# EAGLE design pmu (EAGLE 6.4)
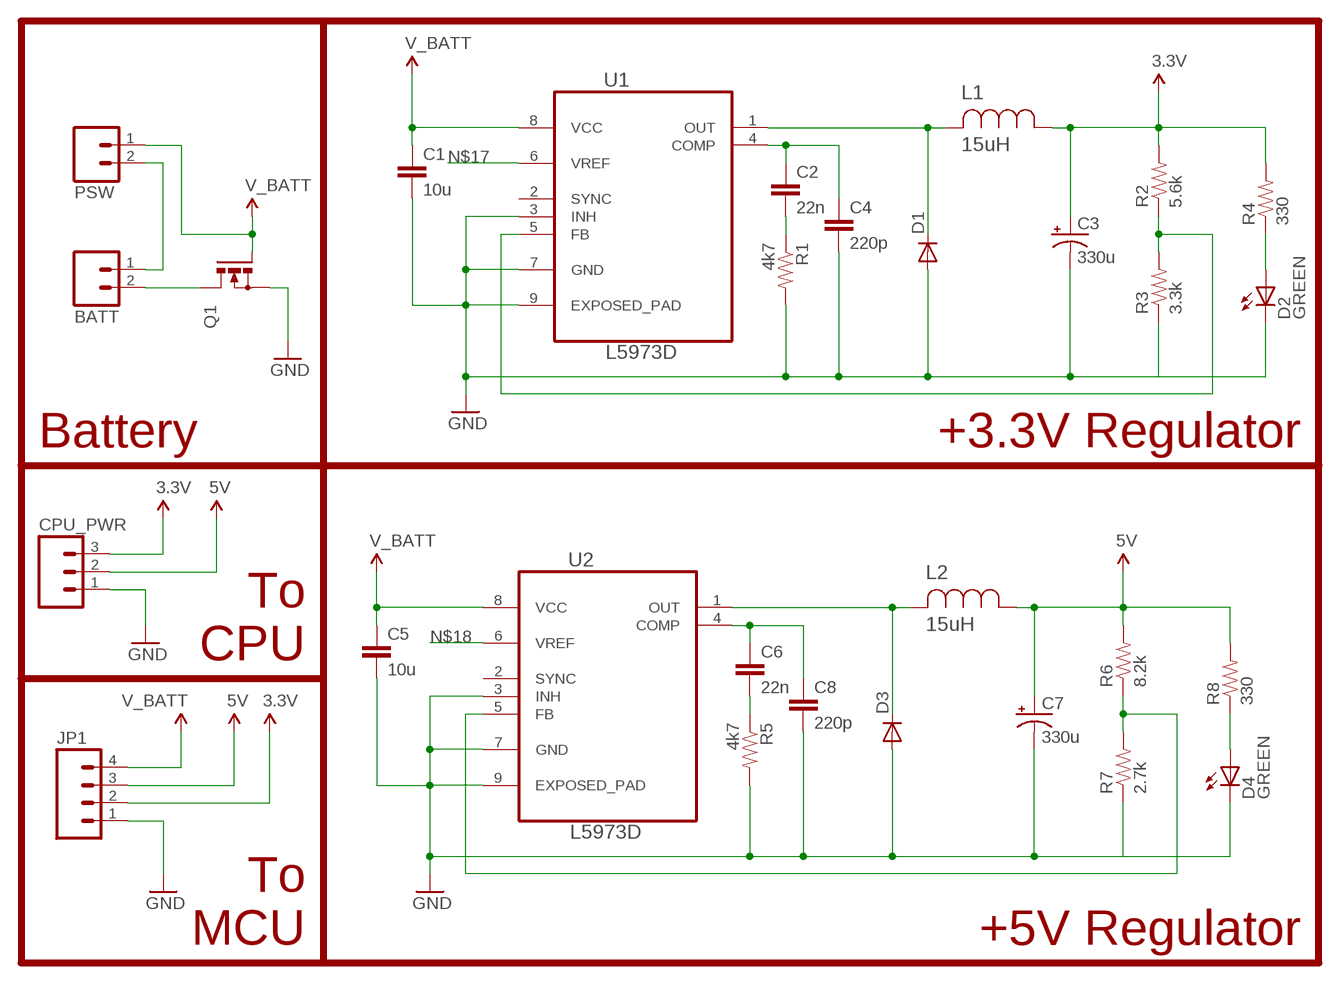
[diagram p0: schematic, sheet 1]

## Parts
BATT  M02PTH  [1X02]
C1  10u  CAP1210  [1210]
C2  22n  CAP0805  [0805]
C3  330u  CAP_POL7343  [EIA7343]
C4  220p  CAP0805  [0805]
C5  10u  CAP1210  [1210]
C6  22n  CAP0805  [0805]
C7  330u  CAP_POL7343  [EIA7343]
C8  220p  CAP0805  [0805]
CPU_PWR  M03PTH  [1X03]
D1  DIODESMB  [SMB-DIODE]
D2  GREEN  LEDCHIP-LED0805  [CHIP-LED0805]
D3  DIODESMB  [SMB-DIODE]
D4  GREEN  LEDCHIP-LED0805  [CHIP-LED0805]
JP1  M04PTH  [1X04]
L1  15uH  ELL8TP150MB-8TP  [IND_ELL8TP]
L2  15uH  ELL8TP150MB-8TP  [IND_ELL8TP]
PSW  M02PTH  [1X02]
Q1  N-MOSFET-SO8S  [SO-08]
R1  4k7  RESISTOR0805-RES  [0805]
R2  5.6k  RESISTOR0805-RES  [0805]
R3  3.3k  RESISTOR0805-RES  [0805]
R4  330  RESISTOR0805-RES  [0805]
R5  4k7  RESISTOR0805-RES  [0805]
R6  8.2k  RESISTOR0805-RES  [0805]
R7  2.7k  RESISTOR0805-RES  [0805]
R8  330  RESISTOR0805-RES  [0805]
U1  L5973D  [SOP127P600X170-9N]
U2  L5973D  [SOP127P600X170-9N]

## Nets
3.3V: C3.A(+) CPU_PWR.3 JP1.2 L1.1 R2.2 R4.2
5V: C7.A(+) CPU_PWR.2 JP1.3 L2.1 R6.2 R8.2
GND: C1.2 C3.C(-) C4.2 C5.2 C7.C(-) C8.2 CPU_PWR.1 D1.A D2.C D3.A D4.C JP1.1 Q1.1(S) Q1.2(S) Q1.3(S) R1.2 R3.1 R5.2 R7.1 U1.3(INH) U1.7(GND) U1.9(EXPOSED_PAD) U2.3(INH) U2.7(GND) U2.9(EXPOSED_PAD)
N$1: C2.1 C4.1 U1.4(COMP)
N$2: C2.2 R1.1
N$3: D1.C L1.2 U1.1(OUT)
N$4: BATT.2 Q1.5(D) Q1.6(D) Q1.7(D) Q1.8(D)
N$5: R2.1 R3.2 U1.5(FB)
N$6: D2.A R4.1
N$8: C6.1 C8.1 U2.4(COMP)
N$9: C6.2 R5.1
N$10: D3.C L2.2 U2.1(OUT)
N$11: R6.1 R7.2 U2.5(FB)
N$12: D4.A R8.1
N$17: U1.6(VREF)
N$18: U2.6(VREF)
N$22: BATT.1 PSW.2
V_BATT: C1.1 C5.1 JP1.4 PSW.1 Q1.4(G) U1.8(VCC) U2.8(VCC)
Unconnected: U1.2(SYNC) U2.2(SYNC)

## Notes on the sheet
- Battery | +3.3V Regulator
- To
  CPU
- To
  MCU
- +5V Regulator

## Library data of the parts
BATT PSW = SparkFun-Connectors:M02: Standard 2-pin 0.1" header. Use with - straight break away headers ( PRT-00116) - right angle break away headers (PRT-00553) - swiss pins (PRT-00743) - machine pins (PRT-00117) - female headers (PRT-00115) Molex polarized connector foot print use with: PRT-08233 with associated crimp pins and housings. 2.54_SCREWTERM for use with PRT-10571. 3.5mm Screw Terminal footprints for PRT-08084 5mm Screw Terminal footprints for use with PRT-08433
C1 C2 C4-C6 C8 = SparkFun-Passives:CAP: Capacitor Standard 0603 ceramic capacitor, and 0.1" leaded capacitor.
C3 C7 = SparkFun-Passives:CAP_POL: Capacitor Polarized These are standard SMD and PTH capacitors. Normally 10uF, 47uF, and 100uF in electrolytic and tantalum varieties. Always verify the external diameter of the through hole cap, it varies with capacity, voltage, and manufacturer. The EIA devices should be standard.
CPU_PWR = SparkFun-Connectors:M03: Header 3 Standard 3-pin 0.1" header. Use with straight break away headers (SKU : PRT-00116), right angle break away headers (PRT-00553), swiss pins (PRT-00743), machine pins (PRT-00117), and female headers (PRT-00115). Molex polarized connector foot print use with SKU : PRT-08232 with associated crimp pins and housings.
D1 D3 = SparkFun-DiscreteSemi:DIODE: Diode These are standard reverse protection diodes and small signal diodes. SMA package can handle up to about 1A. SOD-323 can handle about 200mA. What the SOD-323 package when ordering, there are some mfgs out there that are 5-pin packages.
D2 D4 = led:LED: LED OSRAM: - CHIPLED LG R971, LG N971, LY N971, LG Q971, LY Q971, LO R971, LY R971 LH N974, LH R974 LS Q976, LO Q976, LY Q976 LO Q996 - Hyper CHIPLED LW Q18S LB Q993, LB Q99A, LB R99A - SideLED LS A670, LO A670, LY A670, LG A670, LP A670 LB A673, LV A673, LT A673, LW A673 LH A674 LY A675 LS A676, LA A676, LO A676, LY A676, LW A676 LS A679, LY A679, LG A679 - Hyper Micro SIDELED® LS Y876, LA Y876, LO Y876, LY Y876 LT Y87S - SmartLED LW L88C, LW L88S LB L89C, LB L89S, LG L890 LS L89K, LO L89K, LY L89K LS L896, LA L896, LO L896, LY L896 - TOPLED LS T670, LO T670, LY T670, LG T670, LP T670 LSG T670, LSP T670, LSY T670, LOP T670, LYG T670 LG T671, LOG T671, LSG T671 LB T673, LV T673, LT T673, LW T673 LH T674 LS T676, LA T676, LO T676, LY T676, LB T676, LH T676, LSB T676, LW T676 LB T67C, LV T67C, LT T67C, LS T67K, LO T67K, LY T67K, LW E67C LS E67B, LA E67B, LO E67B, LY E67B, LB E67C, LV E67C, LT E67C LW T67C LS T679, LY T679, LG T679 LS T770, LO T770, LY T770, LG T770, LP T770 LB T773, LV T773, LT T773, LW T773 LH T774 LS E675, LA E675, LY E675, LS T675 LS T776, LA T776, LO T776, LY T776, LB T776 LHGB T686 LT T68C, LB T68C - Hyper Mini TOPLED® LB M676 - Mini TOPLED Santana® LG M470 LS M47K, LO M47K, LY M47K Source: http://www.osram.convergy.de LUXEON: - LUMILED® LXK2-PW12-R00, LXK2-PW12-S00, LXK2-PW14-U00, LXK2-PW14-V00 LXK2-PM12-R00, LXK2-PM12-S00, LXK2-PM14-U00 LXK2-PE12-Q00, LXK2-PE12-R00, LXK2-PE12-S00, LXK2-PE14-T00, LXK2-PE14-U00 LXK2-PB12-K00, LXK2-PB12-L00, LXK2-PB12-M00, LXK2-PB14-N00, LXK2-PB14-P00, LXK2-PB14-Q00 LXK2-PR12-L00, LXK2-PR12-M00, LXK2-PR14-Q00, LXK2-PR14-R00 LXK2-PD12-Q00, LXK2-PD12-R00, LXK2-PD12-S00 LXK2-PH12-R00, LXK2-PH12-S00 LXK2-PL12-P00, LXK2-PL12-Q00, LXK2-PL12-R00 Source: www.luxeon.com KINGBRIGHT: KA-3528ASYC Source: www.kingbright.com
JP1 = SparkFun-Connectors:M04: Header 4 Standard 4-pin 0.1" header. Use with straight break away headers (SKU : PRT-00116), right angle break away headers (PRT-00553), swiss pins (PRT-00743), machine pins (PRT-00117), and female headers (PRT-00115). Molex polarized connector foot print use with SKU : PRT-08231 with associated crimp pins and housings. 1MM SMD Version SKU: PRT-10208
L1 L2 = Panasonic-ELL:ELL: Choke Coils; CURRENTRATING: 2.3A; MPN: ELL8TP150MB; OC_FARNELL: 1865673; OC_NEWARK: 56T0928; PACKAGE: SMD; SUPPLIER: PANASONIC; VALUE: 15UH
Q1 = transistor-power:N-MOSFET-SO8: N-Channel MOSFET Example: FDS7760A; N-Channel Logic Level PowerTrench® MOSFET FDS2572; N-Channel UltraFET® Trench MOSFET Source: www.fairchildsemi.com
R1-R8 = SparkFun-Passives:RESISTOR: Resistor Basic schematic elements and footprints for 0603, 1206, and PTH resistors.
U1 U2 = L5973D:L5973D: 2.5 A switch step down switching regulator; MPN: L5973D; OC_FARNELL: 1077145; OC_NEWARK: 05M3335; PACKAGE: HSOP8; SUPPLIER: STMICROELECTRONICS

## Board
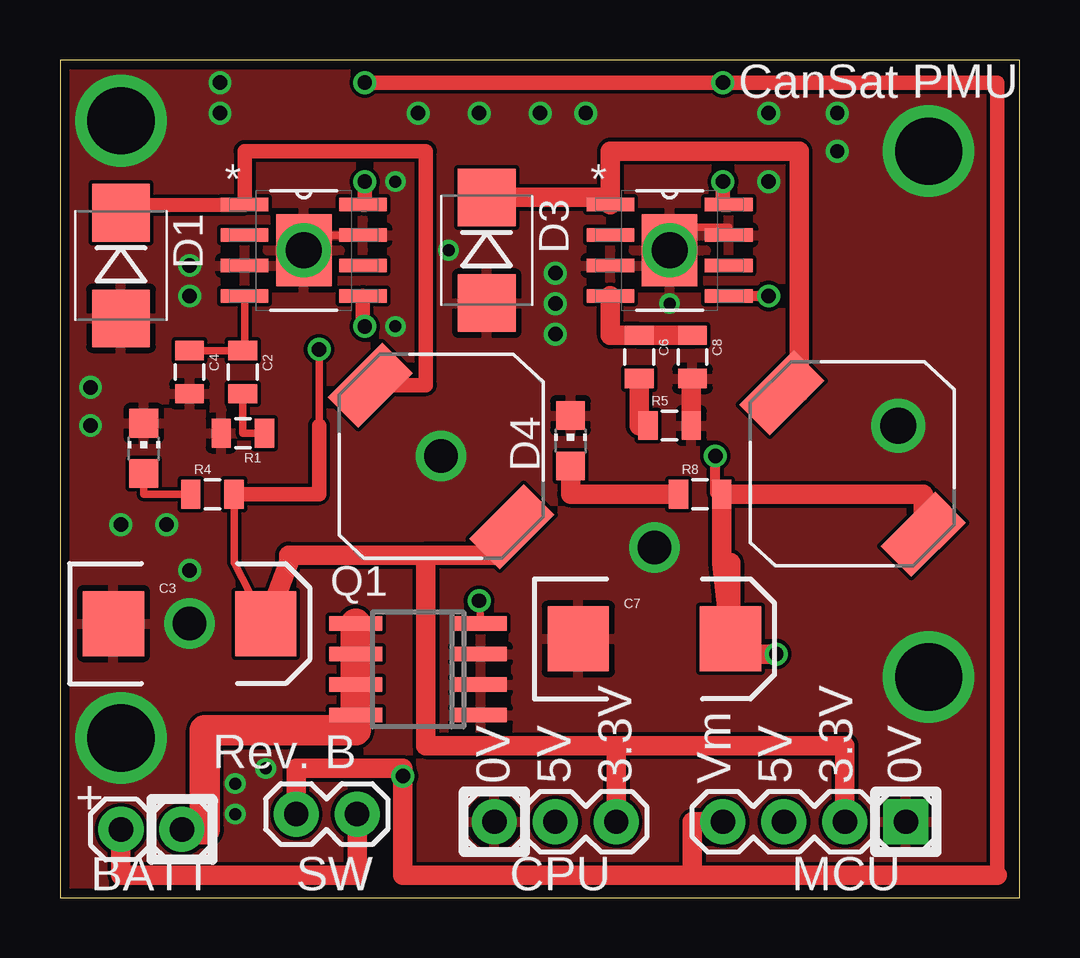
[diagram p1: board, top side]
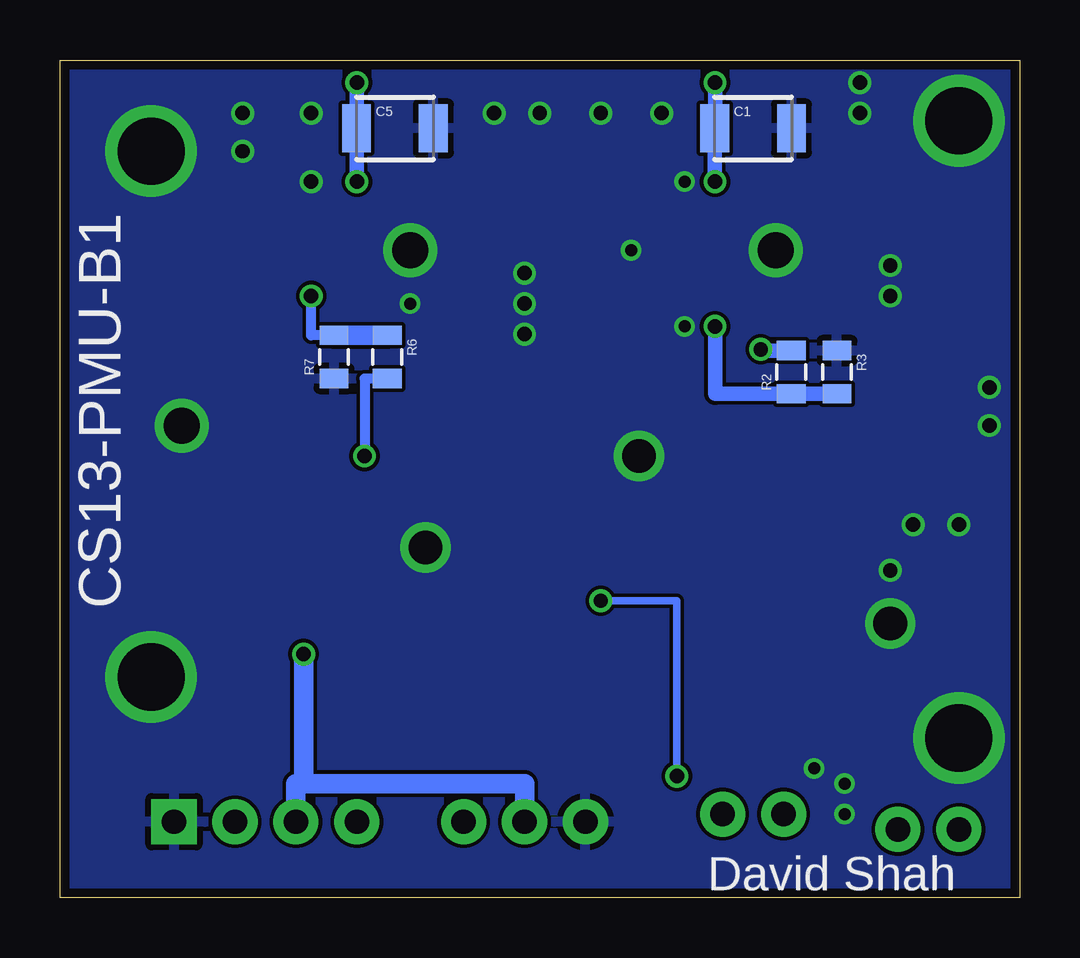
[diagram p2: board, bottom side, seen from below]

Size 39.99 x 34.91 mm. Coordinates in mm from the lower left corner, seen from the top.
Outline: 0,0 39.99,0 39.99,34.91 0,34.91 0,0
Copper layers (1*16): Top 0.0356mm / dielectric 1.5011mm / Bottom 0.0356mm
Design rules "LaenPCBOrder *": minimum track width 6mil, minimum drill 13mil, track to track 6mil, track to pad 6mil, pad to pad 6mil, via to via 6mil, smd to smd 6mil, copper to edge 15mil, drill to drill 6mil, minimum pad ring 7mil, minimum via ring 7mil, stop-mask expansion 4mil, vias tented up to drill 28mil, thermal gap 10mil

### Footprints (pad centres in the part's own frame; a part is rotated, then mirrored left to right if it is on the bottom)
1X02 = drill 1.016 pad 1.88: 1 0,0; 2 2.54,0
1210 = smd 1.2 x 2: 1 -1.6,0; 2 1.6,0
0805 = smd 0.8 x 1.2: 1 -0.9,0; 2 0.9,0
EIA7343 = smd 2.55 x 2.7: A 3.17,0; C -3.17,0
1X03 = drill 1.016 pad 1.88: 1 0,0; 2 2.54,0; 3 5.08,0
SMB-DIODE = smd 2.4 x 2.4: A 2.2,0; C -2.2,0
CHIP-LED0805 = smd 1.2 x 1.2: A 0,-1.05; C 0,1.05
1X04 = drill 1.016 pad 1.88 square: 1 0,0 | drill 1.016 pad 1.88: 2 2.54,0; 3 5.08,0; 4 7.62,0
IND_ELL8TP = smd 1.8 x 3.2 rotated 45: 1 -2.95,-2.95; 2 2.95,2.95
SO-08 = smd 0.6 x 2.2: 1 -1.905,-2.6; 2 -0.635,-2.6; 3 0.635,-2.6; 4 1.905,-2.6; 5 1.905,2.6; 6 0.635,2.6; 7 -0.635,2.6; 8 -1.905,2.6
SOP127P600X170-9N = smd 1.981 x 0.559: 1 -2.464,1.905; 2 -2.464,0.635; 3 -2.464,-0.635; 4 -2.464,-1.905; 5 2.464,-1.905; 6 2.464,-0.635; 7 2.464,0.635; 8 2.464,1.905 | smd 2.311 x 2.997: 9 0,0

### Placement (x,y rotation side)
BATT  2.54,2.86 0 top
C1  11.11,32.07 0 bottom
C2  7.62,21.91 270 top
C3  5.4,11.43 0 top
C4  5.4,21.91 270 top
C5  26.04,32.07 0 bottom
C6  24.13,22.54 270 top
C7  24.77,10.79 0 top
C8  26.35,22.54 270 top
CPU_PWR  18.1,3.17 0 top
D1  2.54,26.35 270 top
D2  3.49,18.73 0 top
D3  17.78,26.99 270 top
D4  21.27,19.05 0 top
JP1  35.24,3.17 180 top
L1  15.88,18.41 90 top
L2  33.02,18.1 90 top
PSW  9.84,3.49 0 top
Q1  14.92,9.53 90 top
R1  7.62,19.37 180 top
R2  9.53,21.91 90 bottom
R3  7.62,21.91 270 bottom
R4  6.35,16.83 0 top
R5  25.4,19.68 0 top
R6  26.35,22.54 270 bottom
R7  28.57,22.54 90 bottom
R8  26.67,16.83 0 top
U1  10.16,26.99 0 top
U2  25.4,26.99 0 top

### Tracks (layer width: path | path; a pad name or v marks a point on that pad's centre or on a via)
3.3V  (via drill 0.6)
  Top 0.305: C3.A 7.25,13.97 R4.2 | 10.79,19.68 v10.79,22.86
  Top 0.61: R4.2 10.79,16.83 10.79,19.68
  Top 0.813: C3.A 9.53,13.97 9.53,14.29 15.24,14.29 | L1.1 18.19,14.29 15.24,14.29 | 15.24,14.29 15.24,6.35 23.18,6.35 | 23.18,6.35 CPU_PWR.3 | 23.18,6.35 32.7,6.35 JP1.2
  Bottom 0.61: R2.2 10.79,22.81 v10.79,22.86
5V  (via drill 0.6)
  Top 0.406: R8.2 27.3,16.83 v27.3,18.41
  Top 0.813: L2.1 35.97,16.83 R8.2 27.57,13.97 C7.A 27.94,13.97 27.94,10.16 v29.84,10.16
  Bottom 0.406: R6.2 27.3,21.64 v27.3,18.41
  Bottom 0.813: 29.84,4.76 v29.84,10.16 | CPU_PWR.2 20.64,4.76 29.84,4.76 | 29.84,4.76 30.16,4.76 JP1.3
GND  (via drill 0.5, 0.6, 1.4, 1.5, 2.8)
  Top 0.305: 9.53,26.04 9.53,26.99 U1.9 10.16,27.62 U1.7 | U2.7 27.86,27.94 26.04,27.94 26.04,26.99 U2.9
  Top 0.813: C8.2 26.3,21.64 R5.2
  other vias: 2.54,15.56 4.45,15.56 6.67,33.97 6.67,32.7 14.92,32.7 17.46,32.7 20,32.7 21.91,32.7 29.53,32.7 32.38,32.7 32.38,31.11 29.53,29.84 20.64,24.77 20.64,26.04 20.64,23.5 1.27,19.68 1.27,21.27 5.4,26.35 5.4,25.08 5.4,13.65 25.4,26.99 10.16,26.99 34.92,19.68 15.88,18.41 5.4,11.43 24.77,14.61 16.19,26.99 13.97,29.84 7.3,3.49 7.3,4.76 8.57,5.4 25.4,24.77 13.97,23.81 2.54,32.38 36.2,31.11 36.2,9.21 2.54,6.67
  pour Top: -0.32,35.56 -0.32,-0.64 40.64,-0.64 40.64,35.56
  pour Bottom: -0.95,35.88 -1.27,-1.59 41.27,-1.59 41.27,36.2
N$1
  Top 0.305: C4.1 C2.1 7.7,22.81 U1.4
N$2
  Top 0.305: R1.1 7.62,19.37 C2.2
N$3
  Top 0.61: D1.C 2.3,28.87 U1.1 7.7,31.11 15.24,31.11 15.24,21.36 L1.2
N$4
  Top 1.27: BATT.2 6.03,2.86 6.03,6.99 12.32,6.99 Q1.8 Q1.7 Q1.6 Q1.5
N$5  (via drill 0.6)
  Top 0.61: v12.7,23.81 12.62,23.81 U1.5
  Bottom 0.61: v12.7,23.81 12.7,21.01 R2.1 R3.2
N$6
  Top 0.305: R4.1 3.49,16.83 D2.A
N$8
  Top 0.813: U2.4 22.94,23.44 C6.1 C8.1
N$9
  Top 0.813: R5.1 24.13,19.68 C6.2
N$10
  Top 0.813: D3.C 22.94,29.19 U2.1 22.94,31.11 30.8,31.11 30.8,21.05 L2.2
N$11  (via drill 0.6)
  Top 0.406: U2.5 v29.53,25.08
  Bottom 0.406: R6.1 29.53,23.44 v29.53,25.08
  Bottom 0.813: R7.2 R6.1
N$12
  Top 0.813: D4.A 21.27,16.83 R8.1
N$22
  Top 0.813: BATT.1 2.54,0.95 12.38,0.95 PSW.2
V_BATT  (via drill 0.6)
  Top 0.305: Q1.4 v17.46,12.38
  Top 0.61: U1.8 12.7,28.89 v12.7,29.84 | U2.8 27.62,28.89 v27.62,29.84 | v12.7,33.97 v27.62,33.97 39.05,33.97 39.05,0.95
  Top 0.813: PSW.1 9.84,5.4 14.29,5.4 v14.29,5.08 14.29,0.95 26.35,0.95 | 26.35,0.95 39.05,0.95 | JP1.4 26.35,3.17 26.35,0.95
  Bottom 0.305: v17.46,12.38 14.29,12.38 v14.29,5.08
  Bottom 0.61: v12.7,29.84 12.71,29.84 C1.1 v12.7,33.97 | v27.62,29.84 27.64,29.84 C5.1 27.62,32.07 v27.62,33.97

### Text on the board
tNames: CanSat PMU | Rev. B | 0V | 5V | 3.3V | Vm | 5V | 3.3V | 0V | + | - | BATT | SW | CPU | MCU
bNames: CS13-PMU-B1 | David Shah